# EAGLE design interface_dac_sma_feedback_2PS_ADC_detector_SMD (EAGLE 7.2.0)
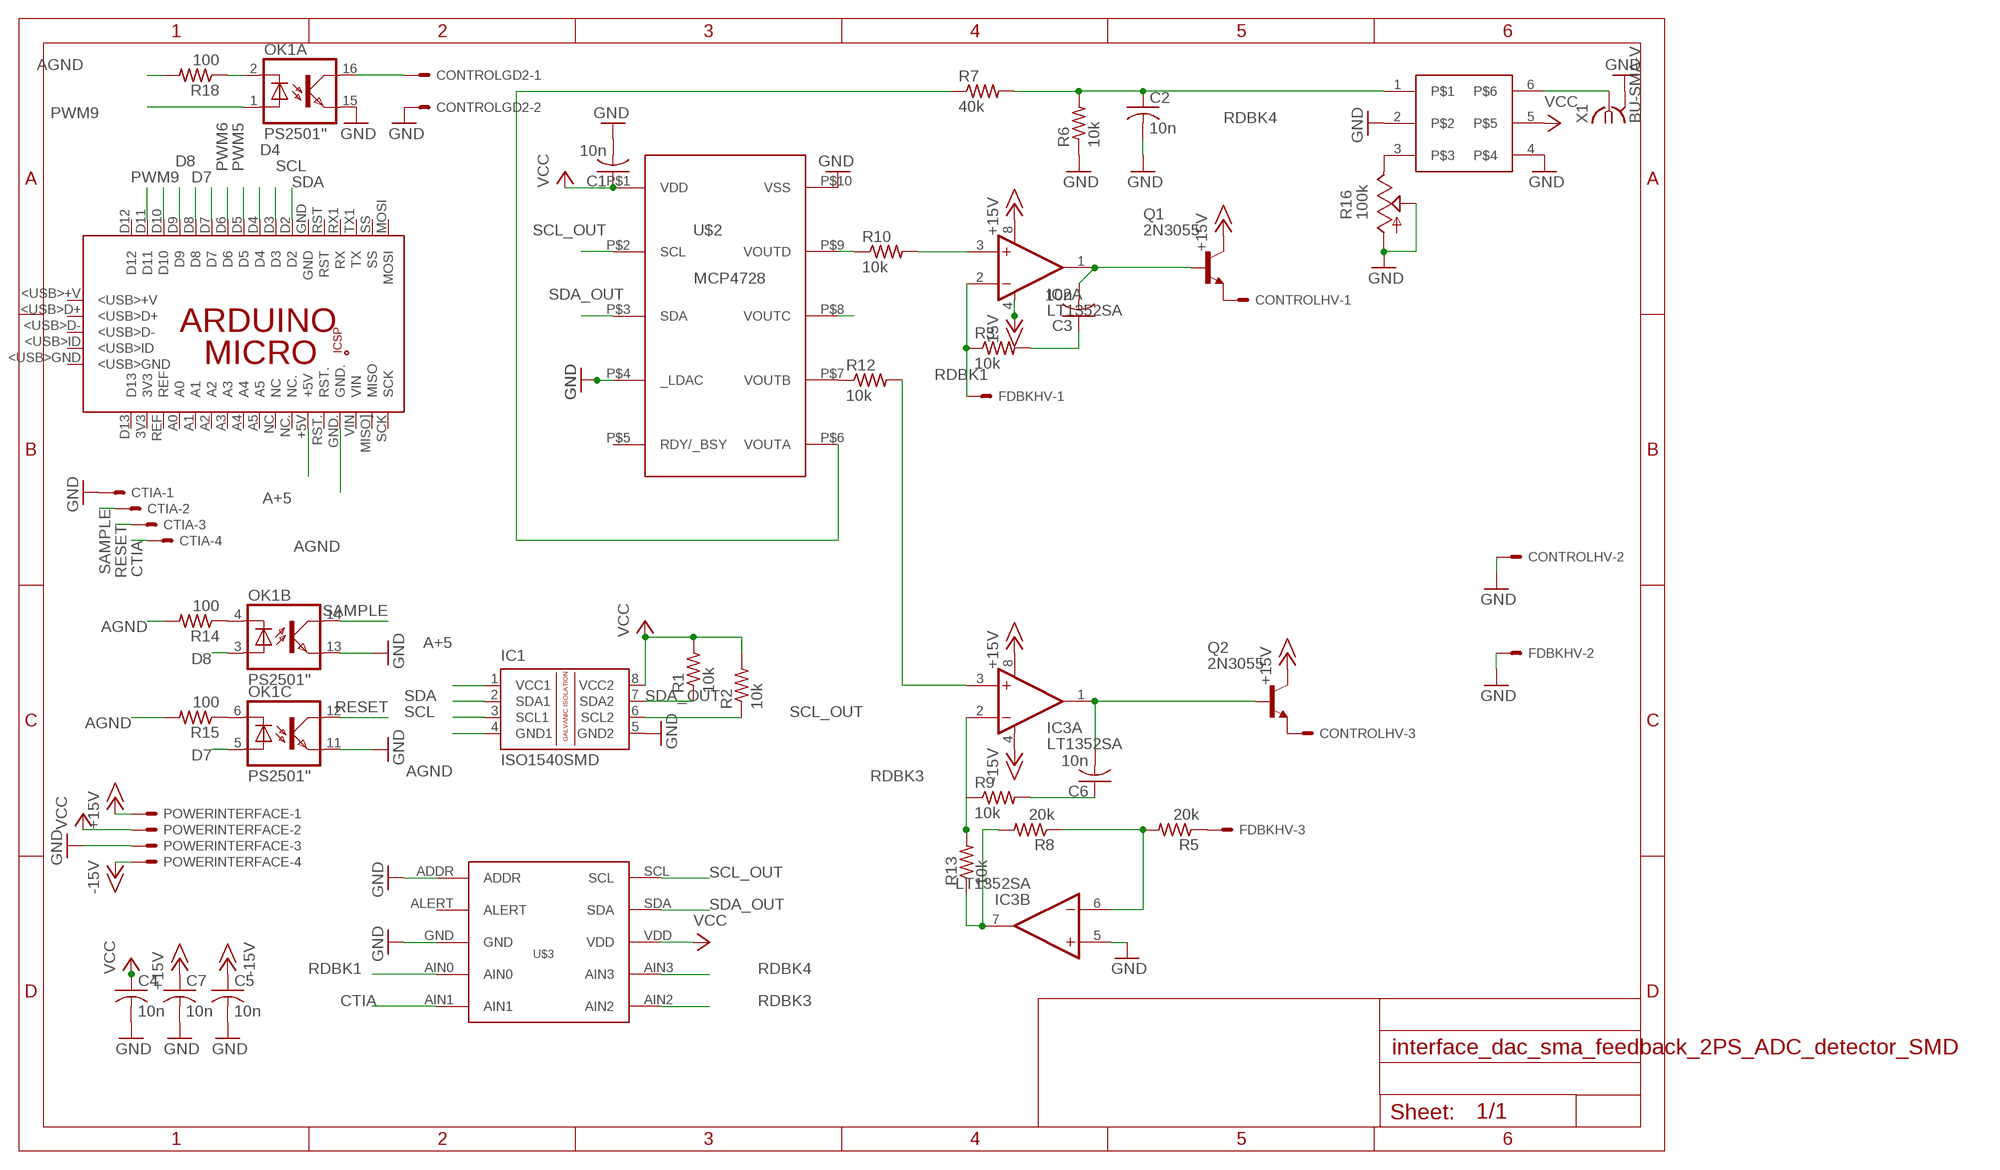
[diagram p0: schematic, sheet 1]

## Parts
C1  10n  C-USC0805  [C0805]
C2  10n  C-USC0805  [C0805]
C3  10n  C-USC0805  [C0805]
C4  10n  C-USC0805  [C0805]
C5  10n  C-USC0805  [C0805]
C6  10n  C-USC0805  [C0805]
C7  10n  C-USC0805  [C0805]
CONTROLGD2  KK-156-2  [KK-156-2]
CONTROLHV  KK-156-3  [KK-156-3]
CTIA  KK-156-4  [KK-156-4]
FDBKHV  KK-156-3  [KK-156-3]
IC1  ISO1540SMD  [SOIC8]
IC2  LT1352SA  [SO08]
IC3  LT1352SA  [SO08]
OK1  PS2501"  [DIL16]
PCB1  ARDUINO_MICRO  [ARDUINO_MICRO]
POWERINTERFACE  KK-156-4  [KK-156-4]
Q1  2N3055  [TO3]
Q2  2N3055  [TO3]
R1  10k  R-US_R0805  [R0805]
R2  10k  R-US_R0805  [R0805]
R3  10k  R-US_R0805  [R0805]
R5  20k  R-US_R0805  [R0805]
R6  10k  R-US_R0805  [R0805]
R7  40k  R-US_R0805  [R0805]
R8  20k  R-US_R0805  [R0805]
R9  10k  R-US_R0805  [R0805]
R10  10k  R-US_R0805  [R0805]
R12  10k  R-US_R0805  [R0805]
R13  10k  R-US_R0805  [R0805]
R14  100  R-US_R0805  [R0805]
R15  100  R-US_R0805  [R0805]
R16  100k  TRIM_US-B90P  [SP19L]
R18  100  R-US_R0805  [R0805]
U$1  LTC6992SMD  [SOT23-6]
U$2  MCP4728  [MSOP-10]
U$3  ADS1015  [VSOP-10]
X1  BU-SMA-V  [BU-SMA-V]

## Nets
+15V: C7.1 IC2.8(A:V+) IC3.8(A:V+) POWERINTERFACE.1 Q1.C Q1.C/(C) Q2.C Q2.C/(C)
-15V: C5.1 IC2.4(A:V-) IC3.4(A:V-) POWERINTERFACE.4
A+5: IC1.1(VCC1) PCB1.+5V
AGND: IC1.4(GND1) PCB1.GND. R14.2 R15.2 R18.2
CTIA: CTIA.4 U$3.AIN1
D4: PCB1.D4
D7: OK1.5(C:A) PCB1.D7
D8: OK1.3(B:A) PCB1.D8
D10: PCB1.D10
D11: PCB1.D11
ENSW2: CONTROLGD2.1 OK1.16(A:COL)
GND: C1.2 C2.2 C4.2 C5.2 C7.2 CONTROLGD2.2 CONTROLHV.2 CTIA.1 FDBKHV.2 IC1.5(GND2) IC3.5(B:+IN) OK1.11(C:EMI) OK1.13(B:EMI) OK1.15(A:EMI) POWERINTERFACE.3 R6.1 R16.A R16.S U$1.2 U$1.4 U$2.P$4(_LDAC) U$2.P$10(VSS) U$3.ADDR U$3.GND X1.2 X1.3 X1.4 X1.5
N$1: R7.1 U$2.P$6(VOUTA)
N$2: OK1.4(B:C) R14.1
N$3: C3.1 R3.2
N$4: CONTROLHV.1 Q1.E
N$5: CONTROLHV.3 Q2.E
N$6: OK1.6(C:C) R15.1
N$7: OK1.2(A:C) R18.1
N$8: FDBKHV.3 R5.1
N$12: R16.E U$1.3
N$13: U$1.6 X1.1
N$14: IC3.7(B:OUT) R8.2 R13.1
N$16: IC2.3(A:+IN) R10.2
N$18: IC3.3(A:+IN) R12.2
N$19: C3.2 IC2.1(A:OUT) Q1.B
N$20: C6.1 R9.2
N$21: C6.2 IC3.1(A:OUT) Q2.B
N$23: IC3.6(B:-IN) R5.2 R8.1
N$24: R10.1 U$2.P$9(VOUTD)
N$25: R12.1 U$2.P$7(VOUTB)
N$26: U$2.P$8(VOUTC)
PWM5: PCB1.D5
PWM6: PCB1.D6
PWM9: OK1.1(A:A) PCB1.D9
RDBK1: FDBKHV.1 IC2.2(A:-IN) R3.1 U$3.AIN0
RDBK3: IC3.2(A:-IN) R9.1 R13.2 U$3.AIN2
RDBK4: C2.1 R6.2 R7.2 U$1.1 U$3.AIN3
RESET: CTIA.3 OK1.12(C:COL)
SAMPLE: CTIA.2 OK1.14(B:COL)
SCL: IC1.3(SCL1) PCB1.D3
SCL_OUT: IC1.6(SCL2) R2.1 U$2.P$2(SCL) U$3.SCL
SDA: IC1.2(SDA1) PCB1.D2
SDA_OUT: IC1.7(SDA2) R1.1 U$2.P$3(SDA) U$3.SDA
VCC: C1.1 C4.1 IC1.8(VCC2) POWERINTERFACE.2 R1.2 R2.2 U$1.5 U$2.P$1(VDD) U$3.VDD
Unconnected: IC2.5(B:+IN) IC2.6(B:-IN) IC2.7(B:OUT) OK1.7(D:A) OK1.8(D:C) OK1.9(D:EMI) OK1.10(D:COL) PCB1.3V3 PCB1.5V PCB1.<USB>+V PCB1.<USB>D+ PCB1.<USB>D- PCB1.<USB>GND PCB1.<USB>ID PCB1.A0 PCB1.A1 PCB1.A2 PCB1.A3 PCB1.A4 PCB1.A5 PCB1.D12 PCB1.D13 PCB1.GND PCB1.GND_ PCB1.MISO. PCB1.MISO](MISO) PCB1.MOSI PCB1.MOSI. PCB1.NC PCB1.NC. PCB1.REF PCB1.RESET.. PCB1.RST PCB1.RST. PCB1.RX1(RX) PCB1.SCK PCB1.SCK. PCB1.SS PCB1.TX1(TX) PCB1.VIN U$2.P$5(RDY/_BSY) U$3.ALERT

## Library data of the parts
C1 = rcl:C-US: CAPACITOR, American symbol
C2-C7 = resistor:C-US: CAPACITOR, American symbol
CONTROLGD2 = con-molex:KK-156-2: KK 156 HEADER Source: http://www.molex.com/pdm_docs/sd/026604100_sd.pdf; OC_FARNELL: unknown; OC_NEWARK: unknown
CONTROLHV FDBKHV = con-molex:KK-156-3: KK 156 HEADER Source: http://www.molex.com/pdm_docs/sd/026604100_sd.pdf; OC_FARNELL: unknown; OC_NEWARK: unknown
CTIA POWERINTERFACE = con-molex:KK-156-4: KK 156 HEADER Source: http://www.molex.com/pdm_docs/sd/026604100_sd.pdf; OC_FARNELL: unknown; OC_NEWARK: unknown
IC1 = texas:ISO1540: ISOLATED CAN TRANSCEIVER Source: http://focus.ti.com/lit/ds/symlink/iso1050.pdf
IC2 IC3 = linear-technology:LT1352: Dual Operational Amplifiers Source: http://datasheets.maxim-ic.com/en/ds/ICL7612-ICL764X.pdf; OC_FARNELL: unknown; OC_NEWARK: unknown
OK1 = optocoupler:PS2501: SHARP OPTO COUPLER
PCB1 = E14_Arduino_published:ARDUINO_MICRO: Device for representing an Arduino Micro board with a footprint in an EAGLE design. Created by Dave Young for Element14. More EAGLE documentation at: http://www.element14.com/community/community/knode/cadsoft_eagle
Q1 Q2 = transistor-npn:2N3055: NPN Transistor
R1-R3 R5-R10 R12 R13 = resistor:R-US_: RESISTOR, American symbol
R14 R15 R18 = rcl:R-US_: RESISTOR, American symbol
R16 = pot:TRIM_US-: POTENTIOMETER
U$1 = linear-technology:LTC6992
U$2 = microchip:MCP4728
U$3 = texas:ADS1015
X1 = con-coax:BU-SMA-V: FEMALE SMA CONNECTOR Radiall distributor RS 112-3794; OC_FARNELL: unknown; OC_NEWARK: unknown

## Board
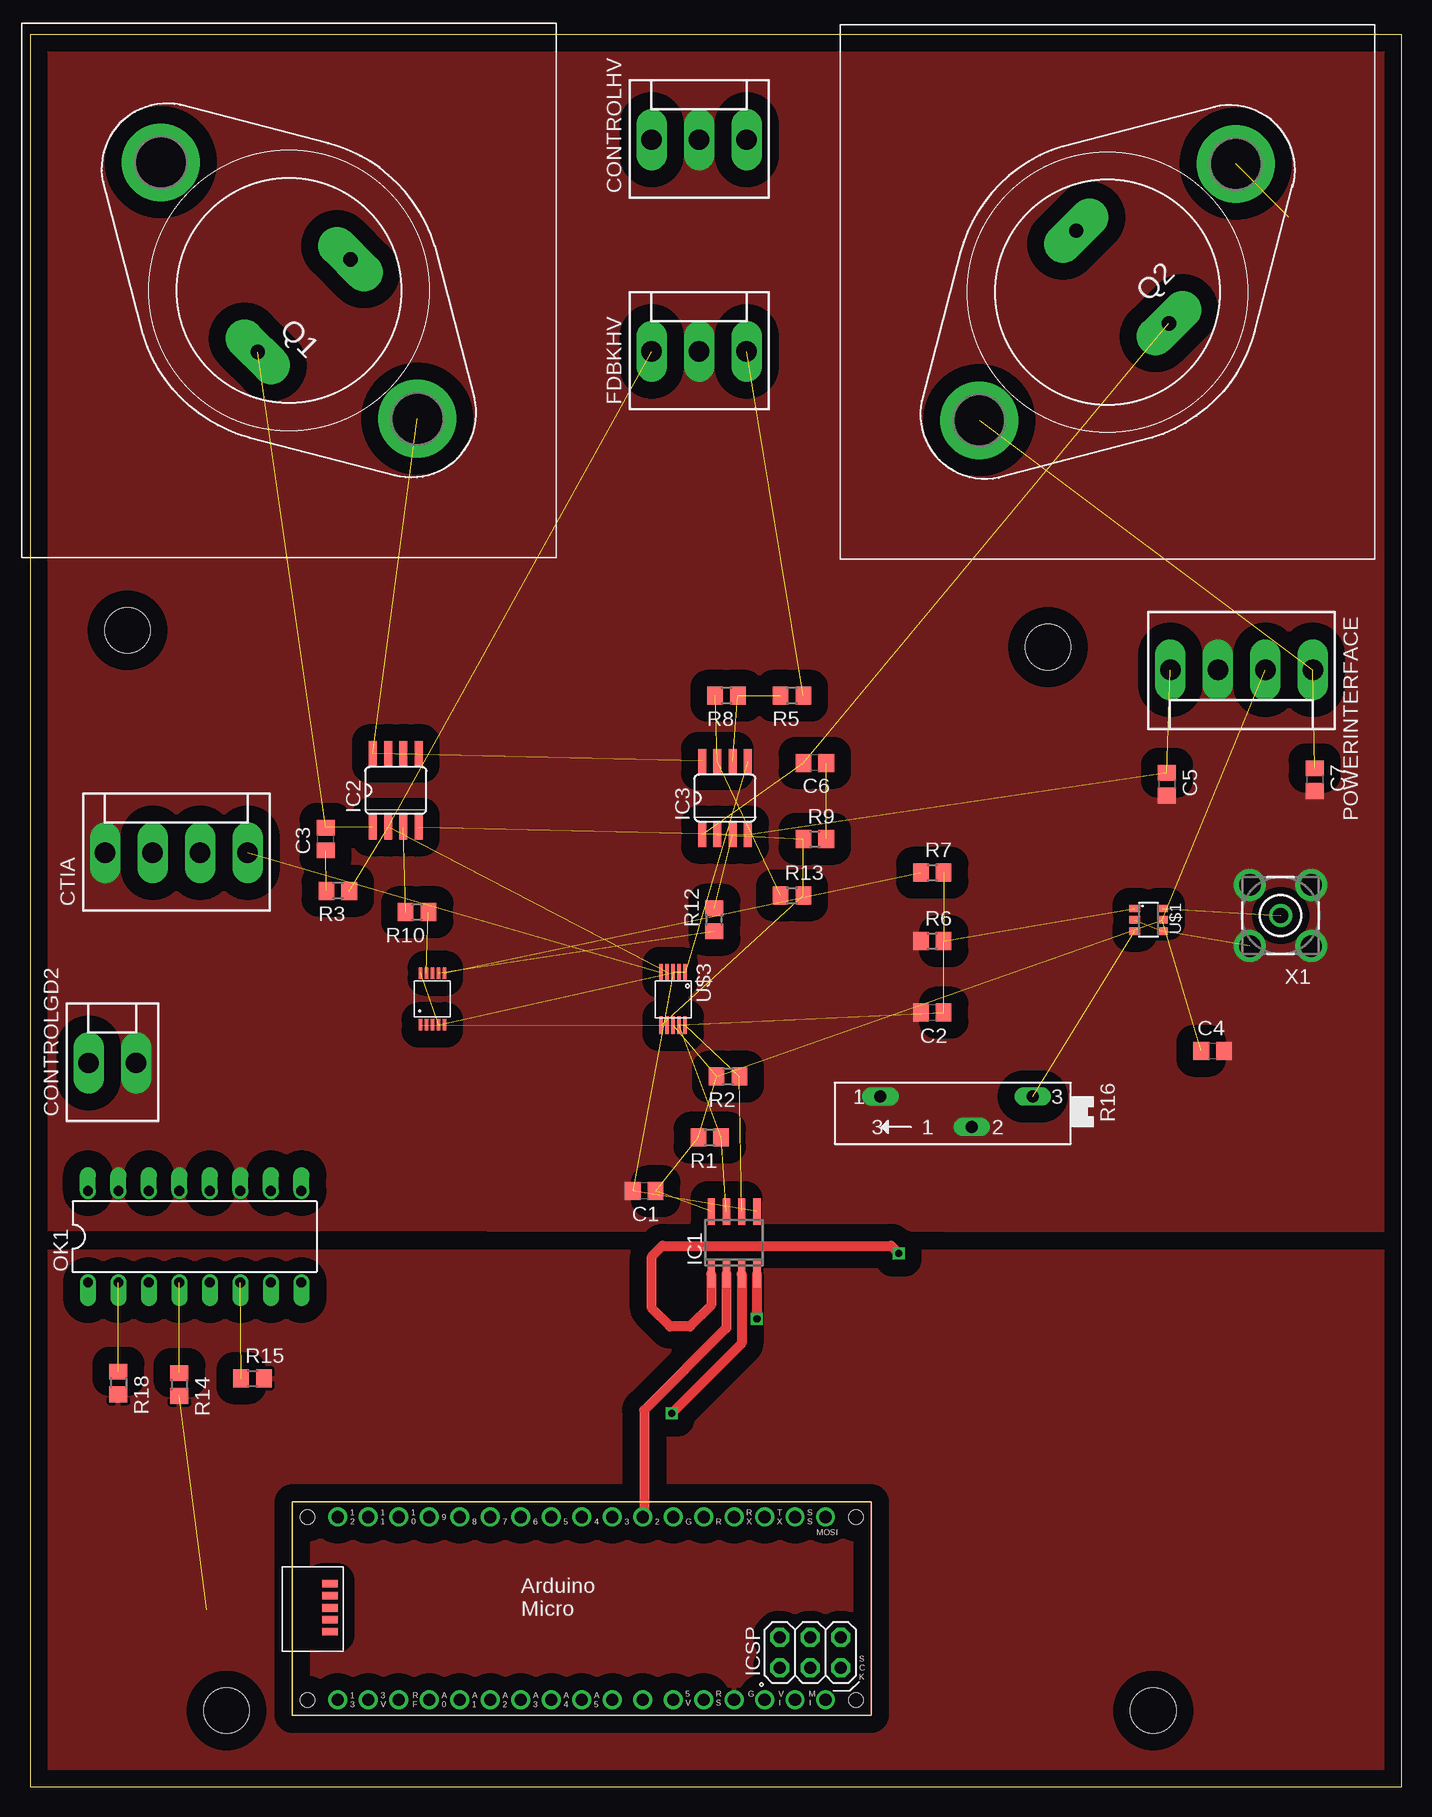
[diagram p1: board, top side]
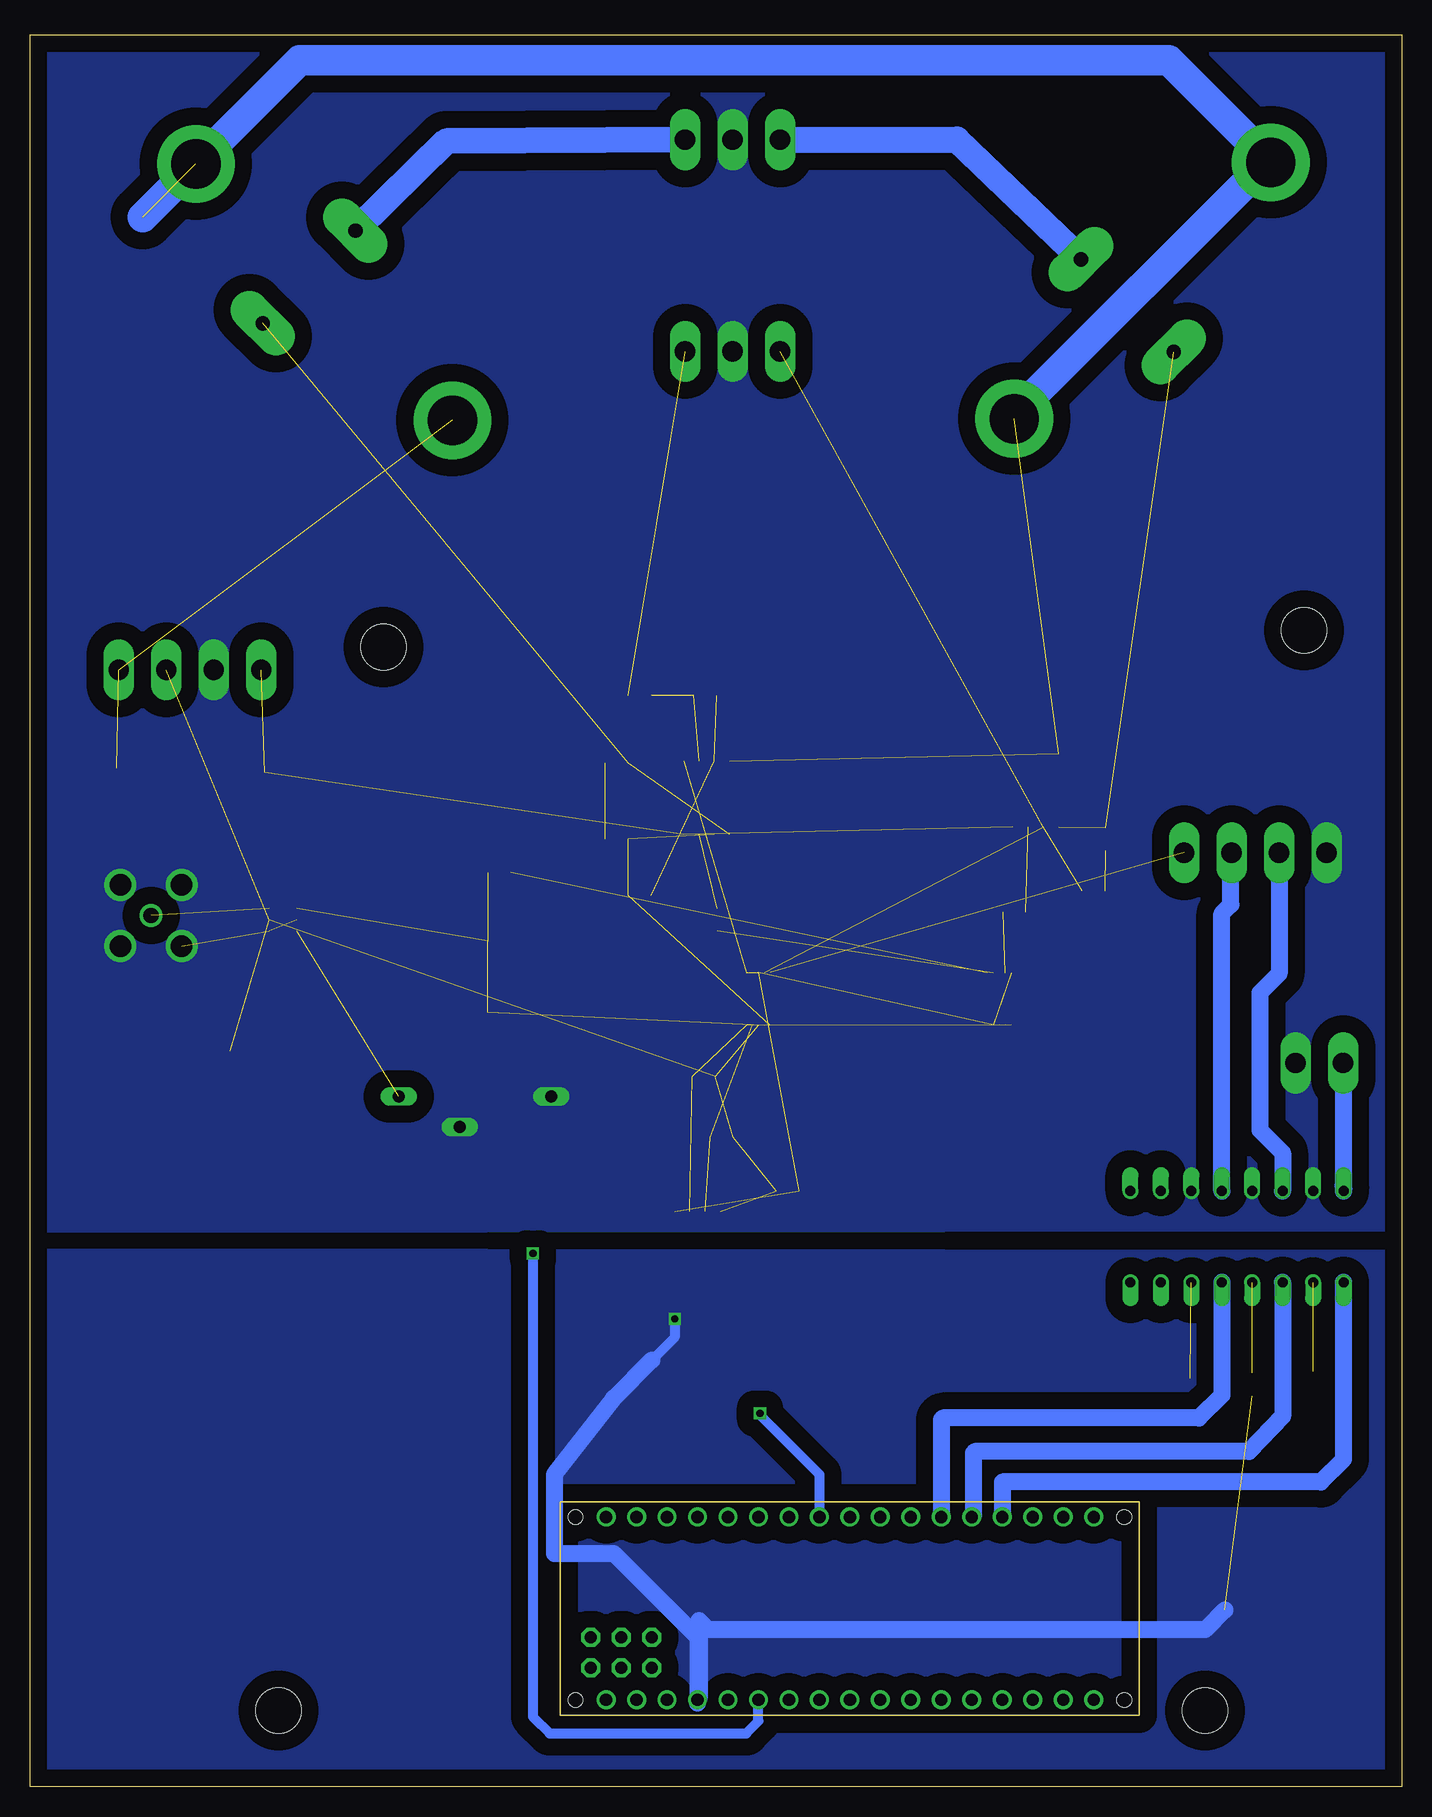
[diagram p2: board, bottom side, seen from below]

Size 114.3 x 146.05 mm. Coordinates in mm from the lower left corner, seen from the top.
Outline: 0,0 114.3,0 114.3,146.05 0,146.05 0,0
Copper layers (1*16): Top 0.035mm / dielectric 1.5mm / Bottom 0.035mm
Design rules "default *": minimum track width 6mil, minimum drill 15mil, track to track 6mil, track to pad 6mil, pad to pad 6mil, via to via 6mil, smd to smd 6mil, copper to edge 40mil, drill to drill 8mil, minimum pad ring 10mil, minimum via ring 8mil, stop-mask expansion 4mil, vias tented up to drill 0mil, thermal gap 10mil
Holes 3.8 mm at 93.6,6.35 16.38,6.35 8.13,96.39 84.84,95

### Footprints (pad centres in the part's own frame; a part is rotated, then mirrored left to right if it is on the bottom)
C0805 = smd 1.3 x 1.5: 1 -0.95,0; 2 0.95,0
KK-156-2 = drill 1.7 pad 2.184 long: 1 -1.98,0; 2 1.98,0
KK-156-3 = drill 1.7 pad 2.184 long: 1 -3.96,0; 2 0,0; 3 3.96,0
KK-156-4 = drill 1.7 pad 2.184 long: 1 -5.94,0; 2 -1.98,0; 3 1.98,0; 4 5.94,0
SOIC8 = smd 0.6 x 2.2: 1 -1.905,-2.6; 2 -0.635,-2.6; 3 0.635,-2.6; 4 1.905,-2.6; 5 1.905,2.6; 6 0.635,2.6; 7 -0.635,2.6; 8 -1.905,2.6
SO08 = smd 0.66 x 2.032: 1 -1.905,-3.073; 2 -0.635,-3.073; 3 0.635,-3.073; 4 1.905,-3.073; 5 1.905,3.073; 6 0.635,3.073; 7 -0.635,3.073; 8 -1.905,3.073
DIL16 = drill 0.813 offset: 1 -8.89,-3.81; 2 -6.35,-3.81; 3 -3.81,-3.81; 4 -1.27,-3.81; 5 1.27,-3.81; 6 3.81,-3.81; 7 6.35,-3.81; 8 8.89,-3.81; 9 8.89,3.81; 10 6.35,3.81; 11 3.81,3.81; 12 1.27,3.81; 13 -1.27,3.81; 14 -3.81,3.81; 15 -6.35,3.81; 16 -8.89,3.81
ARDUINO_MICRO = drill 1.016 pad 1.575: 3V3 6.35,1.27; +5V 31.75,1.27; A0 11.43,1.27; A1 13.97,1.27; A2 16.51,1.27; A3 19.05,1.27; A4 21.59,1.27; A5 24.13,1.27; D2 29.21,16.51; D3 26.67,16.51; D4 24.13,16.51; D5 21.59,16.51; D6 19.05,16.51; D7 16.51,16.51; D8 13.97,16.51; D9 11.43,16.51; D10 8.89,16.51; D11 6.35,16.51; D12 3.81,16.51; D13 3.81,1.27; GND 31.75,16.51; GND. 36.83,1.27; MISO] 41.91,1.27; MOSI 44.45,16.51; NC 26.67,1.27; NC. 29.21,1.27; REF 8.89,1.27; RST 34.29,16.51; RST. 34.29,1.27; RX1 36.83,16.51; SCK 44.45,1.27; SS 41.91,16.51; TX1 39.37,16.51; VIN 39.37,1.27 | drill 1.016 pad 1.575 octagon: 5V 40.64,6.477; GND_ 45.72,6.477; MISO. 40.64,3.937; MOSI. 43.18,6.477; RESET.. 45.72,3.937; SCK. 43.18,3.937 | smd 1.27 x 0.635: <USB>+V 3.15,10.947; <USB>D+ 3.15,9.957; <USB>D- 3.15,8.941; <USB>GND 3.15,6.96; <USB>ID 3.15,7.976 | hole 1.2: 1.27,1.27; 1.27,16.51; 46.99,16.51; 46.99,1.27
TO3 = drill 1.194 pad 3.15 long: B -1.778,5.461; E -1.778,-5.461 | drill 4.115 pad 6.477: C 15.113,0; C/ -15.113,0
R0805 = smd 1.3 x 1.5: 1 -0.95,0; 2 0.95,0
SP19L = drill 1.016 long: A 5.715,-1.27; E -6.985,-1.27; S -1.905,1.27
SOT23-6 = smd 0.6 x 0.9: 1 -0.95,-1.15; 2 0,-1.15; 3 0.95,-1.15; 4 0.95,1.15; 5 0,1.15; 6 -0.95,1.15
MSOP-10 = smd 0.95 x 0.3: P$1 -2.15,1; P$2 -2.15,0.5; P$3 -2.15,0; P$4 -2.15,-0.5; P$5 -2.15,-1; P$6 2.15,-1; P$7 2.15,-0.5; P$8 2.15,0; P$9 2.15,0.5; P$10 2.15,1
VSOP-10 = smd 1.45 x 0.3: ADDR -2.2,1; AIN0 -2.2,-0.5; AIN1 -2.2,-1; AIN2 2.2,-1; AIN3 2.2,-0.5; ALERT -2.2,0.5; GND -2.2,0; SCL 2.2,1; SDA 2.2,0.5; VDD 2.2,0
BU-SMA-V = drill 1.27: 1 0,0 | drill 1.778: 2 -2.55,2.55; 3 2.55,2.55; 4 2.55,-2.55; 5 -2.55,-2.55

### Placement (x,y rotation side)
C1  51.18,49.66 180 top
C2  75.18,64.52 180 top
C3  24.64,78.99 90 top
C4  98.55,61.34 0 top
C5  94.74,83.57 270 top
C6  65.41,85.34 180 top
C7  107.06,83.95 270 top
CONTROLGD2  6.86,60.33 0 top
CONTROLHV  55.75,137.29 0 top
CTIA  12.19,77.85 0 top
FDBKHV  55.75,119.63 0 top
IC1  58.67,45.34 0 top
IC2  30.48,83.06 0 top
IC3  57.91,82.42 0 top
OK1  13.72,45.85 0 top
PCB1  21.84,5.97 0 top
POWERINTERFACE  100.97,93.09 180 top
Q1  21.59,124.71 135 top
Q2  89.79,124.59 225 top
R1  56.64,54.1 180 top
R2  58.17,59.18 180 top
R3  25.65,74.68 180 top
R5  63.5,90.93 180 top
R6  75.18,70.48 0 top
R7  75.18,76.2 0 top
R8  58.04,90.93 180 top
R9  65.41,78.99 0 top
R10  32.26,72.9 180 top
R12  57.02,72.26 90 top
R13  63.5,74.3 0 top
R14  12.45,33.53 270 top
R15  18.54,34.04 0 top
R16  76.58,56.26 180 top
R18  7.37,33.66 270 top
U$1  93.22,72.26 270 top
U$2  33.53,65.66 90 top
U$3  53.59,65.66 270 top
X1  104.22,72.62 180 top

### Tracks (layer width: path | path; a pad name or v marks a point on that pad's centre or on a via)
+15V  (5 unrouted)
  Bottom 2.54: 104.9,130.81 91.82,143.89 19.39,143.89 Q1.C | Q1.C/ 32.28,114.41 11.05,135.64
-15V  (3 unrouted)
A+5  (via drill 0.6)
  Top 0.813: IC1.1 56.77,40.13 54.99,38.35 53.34,38.35 51.82,39.88 51.82,44.2 52.7,45.09 71.75,45.09 v72.39,44.45
  Bottom 0.813: v72.39,44.45 72.39,5.84 70.99,4.45 54.61,4.45 53.59,5.46 PCB1.+5V
AGND  (via drill 0.6)  (1 unrouted)
  Top 0.813: IC1.4 v60.58,38.99
  Bottom 0.813: v60.58,38.99 60.58,37.47 65.66,32.38
  Bottom 1.422: 62.48,35.56 65.66,32.38 70.61,26.04 70.61,19.43 65.66,19.43 58.67,12.45 PCB1.GND. | PCB1.GND. 58.67,6.99 | 14.73,14.73 16.38,13.08 57.78,13.08 58.55,13.84 58.55,7.37 PCB1.GND.
  pour Bottom (isolate 1.422): -0.13,0.13 114.3,0 114.3,44.7 0,44.58
  pour Top (isolate 1.422): 0,44.58 114.3,44.58 114.3,-0.13 0,-0.13
CTIA  (1 unrouted)
D7
  Bottom 1.422: OK1.5 14.99,32.64 16.89,30.73 38.23,30.73 38.35,30.61 PCB1.D7
D8
  Bottom 1.422: OK1.3 9.91,30.86 12.7,27.94 35.56,27.94 35.69,27.81 35.69,22.61 PCB1.D8
ENSW2
  Bottom 1.422: CONTROLGD2.1 4.88,50.09 OK1.16
GND  (8 unrouted)
  pour Bottom (isolate 1.422, no thermals): 0,146.05 114.3,146.05 114.3,46.35 0,46.48
  pour Top (isolate 1.422, no thermals): 0,146.05 114.3,146.05 114.3,46.35 0,46.48
N$1  (1 unrouted)
N$2  (1 unrouted)
N$3  (1 unrouted)
N$4
  Bottom 2.184: CONTROLHV.1 37.06,137.29 Q1.E
N$5
  Bottom 2.184: CONTROLHV.3 79.6,137.16 Q2.E
N$6  (1 unrouted)
N$7  (1 unrouted)
N$8  (1 unrouted)
N$12  (1 unrouted)
N$13  (1 unrouted)
N$14  (2 unrouted)
N$16  (1 unrouted)
N$18  (1 unrouted)
N$19  (2 unrouted)
N$20  (1 unrouted)
N$21  (2 unrouted)
N$23  (2 unrouted)
N$24  (1 unrouted)
N$25  (1 unrouted)
PWM9
  Bottom 1.422: PCB1.D9 33.27,25.4 6.73,25.4 4.83,27.3 OK1.1
RDBK1  (3 unrouted)
RDBK3  (3 unrouted)
RDBK4  (4 unrouted)
RESET
  Bottom 1.422: OK1.12 14.99,72.77 14.22,73.53 14.22,77.8 CTIA.3
SAMPLE
  Bottom 1.422: CTIA.2 10.21,67.77 11.81,66.17 11.81,54.74 9.91,52.83 OK1.14
SCL  (via drill 0.6)
  Top 0.813: IC1.3 59.31,36.96 v53.47,31.11
  Bottom 0.813: v53.47,31.11 53.47,30.99 48.51,26.04 PCB1.D3
SCL_OUT  (3 unrouted)
SDA
  Top 0.813: IC1.2 58.04,38.23 51.18,31.37 51.18,22.61 PCB1.D2
SDA_OUT  (3 unrouted)
VCC  (8 unrouted)